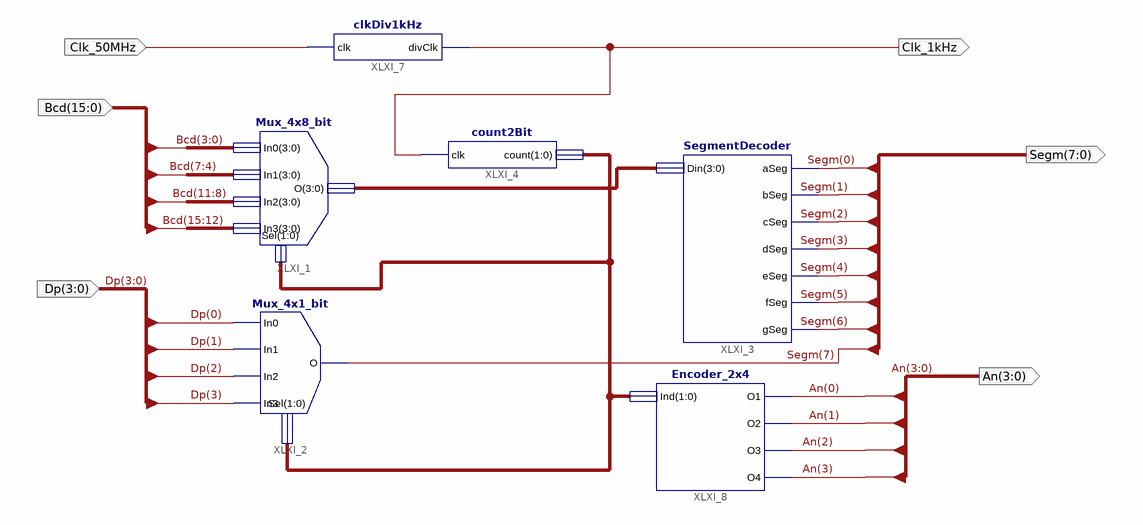
[diagram p0: schematic sheet 1]
// Xilinx ISE schematic Multiplexed_Display.sch (spartan3e) as structural Verilog: 6 symbols, 6 ports
module Multiplexed_Display (
  input  [15:0] Bcd,
  input  [3:0] Dp,
  input  Clk_50MHz,
  output Clk_1kHz,
  output [3:0] An,
  output [7:0] Segm
);

  wire [1:0] XLXN_21;
  wire [3:0] XLXN_23;

  Mux_4x8_bit XLXI_1 (.In0(Bcd[3:0]), .In1(Bcd[7:4]), .In2(Bcd[11:8]), .In3(Bcd[15:12]), .Sel(XLXN_21), .O(XLXN_23));
  Mux_4x1_bit XLXI_2 (.In0(Dp[0]), .In1(Dp[1]), .In2(Dp[2]), .In3(Dp[3]), .O(Segm[7]), .Sel(XLXN_21));
  SegmentDecoder XLXI_3 (
    .Din(XLXN_23), .aSeg(Segm[0]), .bSeg(Segm[1]), .cSeg(Segm[2]), .dSeg(Segm[3]), .eSeg(Segm[4]),
    .fSeg(Segm[5]), .gSeg(Segm[6]));
  count2Bit XLXI_4 (.clk(Clk_1kHz), .count(XLXN_21));
  Encoder_2x4 XLXI_8 (.Ind(XLXN_21), .O1(An[0]), .O2(An[1]), .O3(An[2]), .O4(An[3]));
  clkDiv1kHz XLXI_7 (.clk(Clk_50MHz), .divClk(Clk_1kHz));
endmodule
